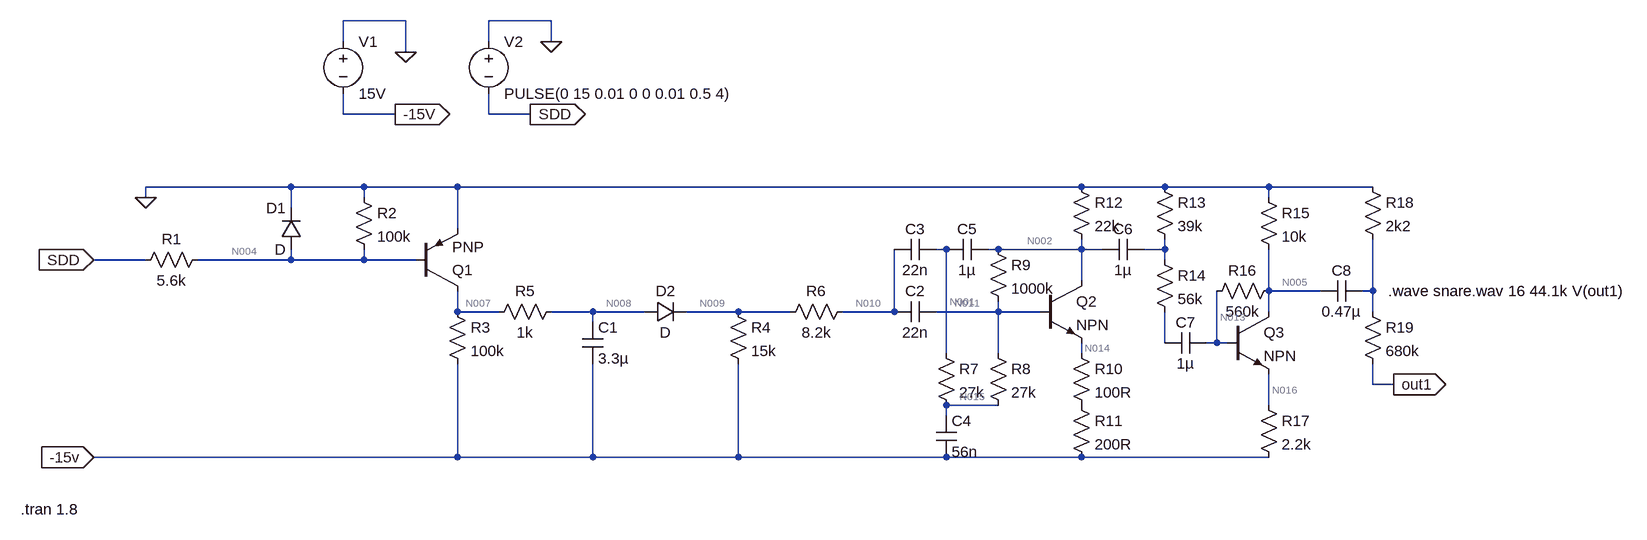
[diagram p0: schematic snare.asc]
snare.asc, the LTspice schematic file:
Version 4
SHEET 1 2248 680
WIRE 336 -128 240 -128
WIRE 560 -128 464 -128
WIRE 240 -96 240 -128
WIRE 464 -96 464 -128
WIRE 560 -96 560 -128
WIRE 336 -80 336 -128
WIRE 240 16 240 -16
WIRE 320 16 240 16
WIRE 464 16 464 -16
WIRE 528 16 464 16
WIRE 160 128 -64 128
WIRE 272 128 160 128
WIRE 416 128 272 128
WIRE 1376 128 416 128
WIRE 1504 128 1376 128
WIRE 1664 128 1504 128
WIRE 1824 128 1664 128
WIRE -64 144 -64 128
WIRE 272 144 272 128
WIRE 1664 144 1664 128
WIRE 160 160 160 128
WIRE 416 192 416 128
WIRE 1168 224 1152 224
WIRE 1248 224 1232 224
WIRE 1376 224 1376 208
WIRE 1376 224 1248 224
WIRE 1408 224 1376 224
WIRE 1504 224 1504 208
WIRE 1504 224 1472 224
WIRE -64 240 -144 240
WIRE 160 240 160 224
WIRE 160 240 16 240
WIRE 272 240 272 224
WIRE 272 240 160 240
WIRE 352 240 272 240
WIRE 1504 240 1504 224
WIRE 1376 272 1376 224
WIRE 1664 288 1664 224
WIRE 1744 288 1664 288
WIRE 1824 288 1824 208
WIRE 1824 288 1808 288
WIRE 416 320 416 288
WIRE 480 320 416 320
WIRE 624 320 560 320
WIRE 704 320 624 320
WIRE 848 320 768 320
WIRE 928 320 848 320
WIRE 1088 320 1088 224
WIRE 1088 320 1008 320
WIRE 1248 320 1248 304
WIRE 1248 320 1152 320
WIRE 1312 320 1248 320
WIRE 1664 320 1664 288
WIRE 1824 320 1824 288
WIRE 624 336 624 320
WIRE 1504 368 1504 320
WIRE 1584 368 1584 288
WIRE 1584 368 1568 368
WIRE 1600 368 1584 368
WIRE 1168 384 1168 224
WIRE 1248 384 1248 320
WIRE 1376 384 1376 368
WIRE 1824 432 1824 400
WIRE 1856 432 1824 432
WIRE 1248 464 1168 464
WIRE 1664 464 1664 416
WIRE 1168 480 1168 464
WIRE 416 544 416 400
WIRE 416 544 -144 544
WIRE 624 544 624 400
WIRE 624 544 416 544
WIRE 848 544 848 400
WIRE 848 544 624 544
WIRE 1168 544 848 544
WIRE 1376 544 1168 544
WIRE 1664 544 1376 544
FLAG -64 144 0
FLAG -144 240 SDD
IOPIN -144 240 In
FLAG -144 544 -15v
IOPIN -144 544 In
FLAG 336 -80 0
FLAG 320 16 -15V
IOPIN 320 16 Out
FLAG 560 -96 0
FLAG 528 16 SDD
IOPIN 528 16 Out
FLAG 1856 432 out1
IOPIN 1856 432 Out
SYMBOL res -80 256 R270
WINDOW 0 32 56 VTop 2
WINDOW 3 0 56 VBottom 2
SYMATTR InstName R1
SYMATTR Value 5.6k
SYMBOL diode 176 224 R180
WINDOW 0 24 64 Left 2
WINDOW 3 24 0 Left 2
SYMATTR InstName D1
SYMBOL res 256 128 R0
SYMATTR InstName R2
SYMATTR Value 100k
SYMBOL pnp 352 288 M180
SYMATTR InstName Q1
SYMBOL res 400 304 R0
SYMATTR InstName R3
SYMATTR Value 100k
SYMBOL cap 608 336 R0
SYMATTR InstName C1
SYMATTR Value 3.3µ
SYMBOL res 832 304 R0
SYMATTR InstName R4
SYMATTR Value 15k
SYMBOL diode 704 336 R270
WINDOW 0 32 32 VTop 2
WINDOW 3 0 32 VBottom 2
SYMATTR InstName D2
SYMBOL res 576 304 R90
WINDOW 0 0 56 VBottom 2
WINDOW 3 32 56 VTop 2
SYMATTR InstName R5
SYMATTR Value 1k
SYMBOL res 1024 304 R90
WINDOW 0 0 56 VBottom 2
WINDOW 3 32 56 VTop 2
SYMATTR InstName R6
SYMATTR Value 8.2k
SYMBOL cap 1152 336 M270
WINDOW 0 32 32 VTop 2
WINDOW 3 0 32 VBottom 2
SYMATTR InstName C2
SYMATTR Value 22n
SYMBOL cap 1152 240 M270
WINDOW 0 32 32 VTop 2
WINDOW 3 0 32 VBottom 2
SYMATTR InstName C3
SYMATTR Value 22n
SYMBOL res 1152 368 R0
SYMATTR InstName R7
SYMATTR Value 27k
SYMBOL cap 1152 480 R0
SYMATTR InstName C4
SYMATTR Value 56n
SYMBOL res 1232 368 R0
SYMATTR InstName R8
SYMATTR Value 27k
SYMBOL cap 1232 208 R90
WINDOW 0 0 32 VBottom 2
WINDOW 3 32 32 VTop 2
SYMATTR InstName C5
SYMATTR Value 1µ
SYMBOL npn 1312 272 R0
SYMATTR InstName Q2
SYMBOL res 1232 208 R0
SYMATTR InstName R9
SYMATTR Value 1000k
SYMBOL res 1360 368 R0
SYMATTR InstName R10
SYMATTR Value 100R
SYMBOL res 1360 448 R0
SYMATTR InstName R11
SYMATTR Value 200R
SYMBOL res 1360 112 R0
SYMATTR InstName R12
SYMATTR Value 22k
SYMBOL cap 1472 208 R90
WINDOW 0 0 32 VBottom 2
WINDOW 3 32 32 VTop 2
SYMATTR InstName C6
SYMATTR Value 1µ
SYMBOL res 1488 112 R0
SYMATTR InstName R13
SYMATTR Value 39k
SYMBOL res 1488 224 R0
SYMATTR InstName R14
SYMATTR Value 56k
SYMBOL cap 1504 384 R270
WINDOW 0 32 32 VTop 2
WINDOW 3 0 32 VBottom 2
SYMATTR InstName C7
SYMATTR Value 1µ
SYMBOL npn 1600 320 R0
SYMATTR InstName Q3
SYMBOL res 1648 128 R0
SYMATTR InstName R15
SYMATTR Value 10k
SYMBOL res 1680 272 R90
WINDOW 0 0 56 VBottom 2
WINDOW 3 32 56 VTop 2
SYMATTR InstName R16
SYMATTR Value 560k
SYMBOL res 1648 448 R0
SYMATTR InstName R17
SYMATTR Value 2.2k
SYMBOL voltage 240 -112 R0
WINDOW 123 0 0 Left 0
WINDOW 39 24 44 Left 2
SYMATTR InstName V1
SYMATTR Value 15V
SYMBOL voltage 464 -112 R0
WINDOW 123 0 0 Left 0
WINDOW 39 0 0 Left 0
SYMATTR InstName V2
SYMATTR Value PULSE(0 15 0.01 0 0 0.01 0.5 4)
SYMBOL cap 1808 272 R90
WINDOW 0 0 32 VBottom 2
WINDOW 3 32 32 VTop 2
SYMATTR InstName C8
SYMATTR Value 0.47µ
SYMBOL res 1808 112 R0
SYMATTR InstName R18
SYMATTR Value 2k2
SYMBOL res 1808 304 R0
SYMATTR InstName R19
SYMATTR Value 680k
TEXT -256 624 Left 2 !.tran 1.8
TEXT 1848 288 Left 2 !.wave snare.wav 16 44.1k V(out1)

The netlist it stands for:
* snare.asc
R1 SDD N004 5.6k
D1 N004 0 D
R2 0 N004 100k
Q1 N007 N004 0 0 PNP
R3 N007 -15v 100k
C1 N008 -15v 3.3µ
R4 N009 -15v 15k
D2 N008 N009 D
R5 N008 N007 1k
R6 N010 N009 8.2k
C2 N011 N010 22n
C3 N001 N010 22n
R7 N001 N015 27k
C4 N015 -15v 56n
R8 N011 N015 27k
C5 N002 N001 1µ
Q2 N002 N011 N014 0 NPN
R9 N002 N011 1000k
R10 N014 P001 100R
R11 P001 -15v 200R
R12 0 N002 22k
C6 N003 N002 1µ
R13 0 N003 39k
R14 N003 N012 56k
C7 N012 N013 1µ
Q3 N005 N013 N016 0 NPN
R15 0 N005 10k
R16 N005 N013 560k
R17 N016 -15v 2.2k
V1 0 -15v 15V
V2 0 SDD PULSE(0 15 0.01 0 0 0.01 0.5 4)
C8 N006 N005 0.47µ
R18 0 N006 2k2
R19 N006 out1 680k
.model D D
.lib standard.dio
.model NPN NPN
.model PNP PNP
.lib standard.bjt
.tran 1.8
.wave snare.wav 16 44.1k V(out1)
.backanno
.end

* Results of the author's LTspice run, read from the files saved beside the schematic
* Operating Point, zero values left out:
*   V(n004) = -79.55 nV
*   V(n007) = -15 V
*   V(-15v) = -15 V
*   V(n008) = -15 V
*   V(n009) = -15 V
*   V(n010) = -15 V
*   V(n011) = -14.11 V
*   V(n001) = -14.11 V
*   V(n015) = -14.11 V
*   V(n002) = -9.734 V
*   V(n014) = -14.87 V
*   V(p001) = -14.91 V
*   V(n013) = -12.47 V
*   V(n005) = -8.02 V
*   V(n016) = -13.24 V
*   Ic(Q3) = 794.1 µA
*   Ib(Q3) = 7.941 µA
*   Ie(Q3) = -802 µA
*   Ic(Q2) = 438.1 µA
*   Ib(Q2) = 4.381 µA
*   Ie(Q2) = -442.4 µA
*   Ic(Q1) = -15 pA
*   Ib(Q1) = 15 pA
*   I(R17) = 802 µA
*   I(R16) = 7.941 µA
*   I(R15) = 802 µA
*   I(R12) = 442.4 µA
*   I(R11) = 442.4 µA
*   I(R10) = 442.4 µA
*   I(R9) = 4.381 µA
*   I(R3) = 15 pA
*   I(R1) = 14.2 pA
*   I(V2) = 14.2 pA
*   I(V1) = -1.244 mA
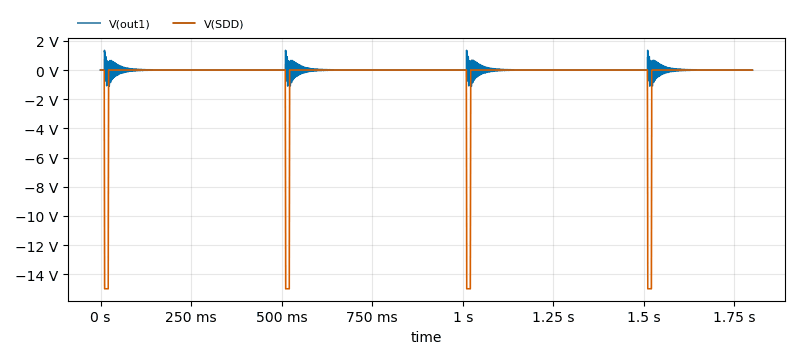
[diagram p1: Transient Analysis of snare.asc, plotted from the saved traces]
* Transient Analysis, 1 run:
*   V(out1): min -1.127 V, max 1.348 V, average 263.3 µV, rms 166.4 mV, last -127.4 µV
*   V(SDD): min -15 V, max 0 V, average -366.7 mV, rms 2.31 V, last 0 V